# Altium schematic sheet MCU.SchDoc
size A3
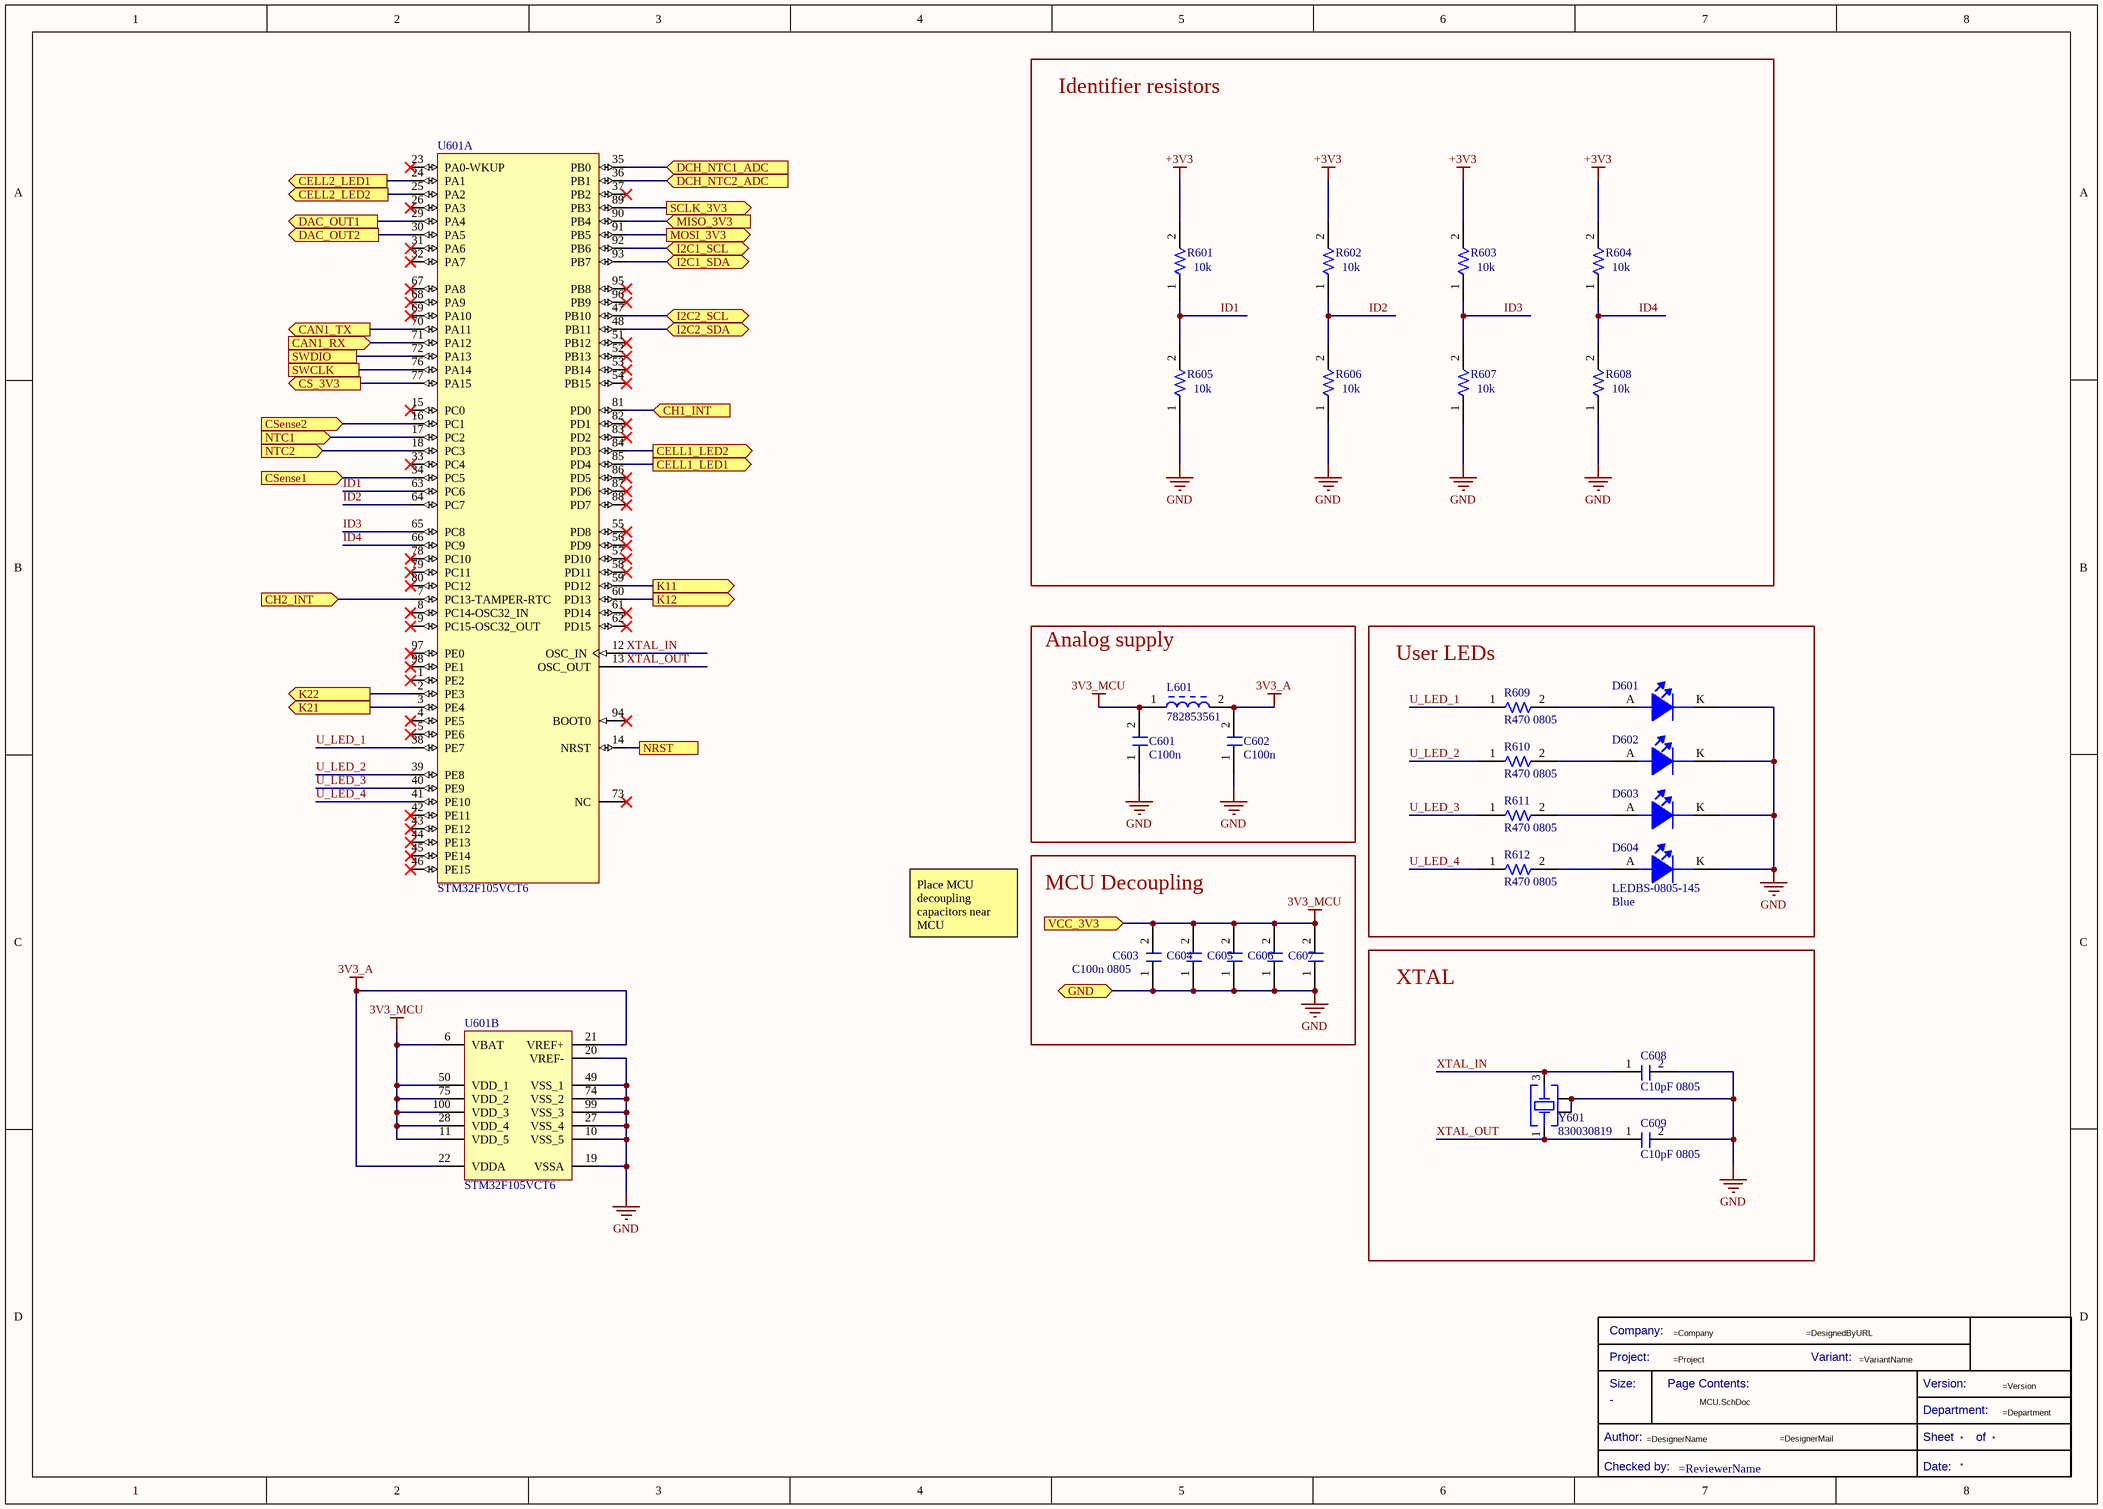
[diagram p0: MCU.SchDoc]

## Parts
*  Title Block_template  (value not drawn)  (graphical)
C601  C100n  [C0805FNPC-R]
C602  C100n  [C0805FNPC-R]
C603  C100n-50V-0805FNPC-X7R  [C0805FNPC-R]  (value not drawn)
C604  C100n-50V-0805FNPC-X7R  [C0805FNPC-R]  (value not drawn)
C605  C100n-50V-0805FNPC-X7R  [C0805FNPC-R]  (value not drawn)
C606  C100n-50V-0805FNPC-X7R  [C0805FNPC-R]  (value not drawn)
C607  C100n 0805  [C0805FNPC-R]
C608  C10pF 0805  [WCAP-CSGP_0805_L2W1.25H0.6_Reflow]
C609  C10pF 0805  [WCAP-CSGP_0805_L2W1.25H0.6_Reflow]
D601  LEDBS-0805-145  [LED_0805_WE]  (value not drawn)
D602  LEDBS-0805-145  [LED_0805_WE]  (value not drawn)
D603  LEDBS-0805-145  [LED_0805_WE]  (value not drawn)
D604  LEDBS-0805-145  Color: Blue  [LED_0805_WE]
L601  782853561  [L_Ferrite_bead_0805]
R601  value 10k  [0805]  (hidden comment: R10k_0805_0.25W)
R602  value 10k  [0805]  (hidden comment: R10k_0805_0.25W)
R603  value 10k  [0805]  (hidden comment: R10k_0805_0.25W)
R604  value 10k  [0805]  (hidden comment: R10k_0805_0.25W)
R605  value 10k  [0805]  (hidden comment: R10k_0805_0.25W)
R606  value 10k  [0805]  (hidden comment: R10k_0805_0.25W)
R607  value 10k  [0805]  (hidden comment: R10k_0805_0.25W)
R608  value 10k  [0805]  (hidden comment: R10k_0805_0.25W)
R609  R470 0805  [R0805FTK]
R610  R470 0805  [R0805FTK]
R611  R470 0805  [R0805FTK]
R612  R470 0805  [R0805FTK]
U601  STM32F105VCT6  [STM-LQFP100_L]  (parts A,B of 2)
Y601  830030819  [WE-XTAL_CFPX-104]

## Blocks framed on the sheet
Identifier resistors: R601-R608
Analog supply: C601 C602 L601
User LEDs: D601-D604 R609-R612
MCU Decoupling: C603-C607
XTAL: C608 C609 Y601

## Ports
CAN1_RX (in), CAN1_TX (out), CELL1_LED1 (out), CELL1_LED2 (out), CELL2_LED1 (out), CELL2_LED2 (out), CH1_INT (in), CH2_INT (in), CS_3V3 (out), CSense1 (in), CSense2 (in), DAC_OUT1 (out), DAC_OUT2 (out), DCH_NTC1_ADC (in), DCH_NTC2_ADC (in), GND (bidir), I2C1_SCL (bidir), I2C1_SDA (bidir), I2C2_SCL (bidir), I2C2_SDA (bidir), K11 (out), K12 (out), K21 (out), K22 (out), MISO_3V3 (in), MOSI_3V3 (out), NRST, NTC1 (in), NTC2 (in), SCLK_3V3 (out), SWCLK, SWDIO, VCC_3V3 (in)

## Nets
3V3_A: C602.2 L601.2 U601.21(VREF+) U601.22(VDDA)
3V3_MCU: C601.2 C603.2 C604.2 C605.2 C606.2 C607.2 L601.1 U601.6(VBAT) U601.11(VDD_5) U601.28(VDD_4) U601.50(VDD_1) U601.75(VDD_2) U601.100(VDD_3) ; port VCC_3V3
+3V3: R601.2 R602.2 R603.2 R604.2
GND: C601.1 C602.1 C603.1 C604.1 C605.1 C606.1 C607.1 C608.2 C609.2 D601.K D602.K D603.K D604.K R605.1 R606.1 R607.1 R608.1 U601.10(VSS_5) U601.19(VSSA) U601.20(VREF-) U601.27(VSS_4) U601.49(VSS_1) U601.74(VSS_2) U601.99(VSS_3) Y601.2(GND_&_Lid) Y601.4(GND_&_Lid) ; port GND
CAN1_RX: U601.71(PA12) ; port CAN1_RX
CAN1_TX: U601.70(PA11) ; port CAN1_TX
CELL1_LED1: U601.85(PD4) ; port CELL1_LED1
CELL1_LED2: U601.84(PD3) ; port CELL1_LED2
CELL2_LED1: U601.24(PA1) ; port CELL2_LED1
CELL2_LED2: U601.25(PA2) ; port CELL2_LED2
CH1_INT: U601.81(PD0) ; port CH1_INT
CH2_INT: U601.7(PC13-TAMPER-RTC) ; port CH2_INT
CS_3V3: U601.77(PA15) ; port CS_3V3
CSense1: U601.34(PC5) ; port CSense1
CSense2: U601.16(PC1) ; port CSense2
DAC_OUT1: U601.29(PA4) ; port DAC_OUT1
DAC_OUT2: U601.30(PA5) ; port DAC_OUT2
DCH_NTC1_ADC: U601.35(PB0) ; port DCH_NTC1_ADC
DCH_NTC2_ADC: U601.36(PB1) ; port DCH_NTC2_ADC
I2C1_SCL: U601.92(PB6) ; port I2C1_SCL
I2C1_SDA: U601.93(PB7) ; port I2C1_SDA
I2C2_SCL: U601.47(PB10) ; port I2C2_SCL
I2C2_SDA: U601.48(PB11) ; port I2C2_SDA
ID1: R601.1 R605.2 U601.63(PC6)
ID2: R602.1 R606.2 U601.64(PC7)
ID3: R603.1 R607.2 U601.65(PC8)
ID4: R604.1 R608.2 U601.66(PC9)
K11: U601.59(PD12) ; port K11
K12: U601.60(PD13) ; port K12
K21: U601.3(PE4) ; port K21
K22: U601.2(PE3) ; port K22
MISO_3V3: U601.90(PB4) ; port MISO_3V3
MOSI_3V3: U601.91(PB5) ; port MOSI_3V3
NRST: U601.14(NRST) ; port NRST
NTC1: U601.17(PC2) ; port NTC1
NTC2: U601.18(PC3) ; port NTC2
SCLK_3V3: U601.89(PB3) ; port SCLK_3V3
SWCLK: U601.76(PA14) ; port SWCLK
SWDIO: U601.72(PA13) ; port SWDIO
U_LED_1: R609.1 U601.38(PE7)
U_LED_2: R610.1 U601.39(PE8)
U_LED_3: R611.1 U601.40(PE9)
U_LED_4: R612.1 U601.41(PE10)
XTAL_IN: C608.1 U601.12(OSC_IN) Y601.3(Crystal)
XTAL_OUT: C609.1 U601.13(OSC_OUT) Y601.1(Crystal)
NetD601_A: D601.A R609.2
NetD602_A: D602.A R610.2
NetD603_A: D603.A R611.2
NetD604_A: D604.A R612.2

Not connected (* = marked no-connect by the designer): U601 1(PE2)* 4(PE5)* 5(PE6)* 8(PC14-OSC32_IN)* 9(PC15-OSC32_OUT)* 15(PC0)* 23(PA0-WKUP)* 26(PA3)* 31(PA6)* 32(PA7)* 33(PC4)* 37(PB2)* 42(PE11)* 43(PE12)* 44(PE13)* 45(PE14)* 46(PE15)* 51(PB12)* 52(PB13)* 53(PB14)* 54(PB15)* 55(PD8)* 56(PD9)* 57(PD10)* 58(PD11)* 61(PD14)* 62(PD15)* 67(PA8)* 68(PA9)* 69(PA10)* 73(NC)* 78(PC10)* 79(PC11)* 80(PC12)* 82(PD1)* 83(PD2)* 86(PD5)* 87(PD6)* 88(PD7)* 94(BOOT0)* 95(PB8)* 96(PB9)* 97(PE0)* 98(PE1)*

## Notes on the sheet
- Place MCU decoupling capacitors near MCU
- (in symbol Title Block_template) Company:; Project:; Variant:; Size:; Page Contents:; Version:; Department:; Author:; Sheet; of; Checked by:; Date:

## Library data of the parts
* = Title Block_template: Standard Title Block; .Creator: GP; Category: Title Block; .PCBcheck: GP; .SCHcheck: GP; Checked by:: =ReviewerName; Size: -
C601 C602 = CMP-00063-3: Cap, 0.1ΜF, 50V, 10%, X7R, 0805; Manufacturer Part Number 1: 885012207098; Manufacturer 1: Wurth Electronics; Value: 100nF; .Creator: DR; ComponentLink2Description: http://www.farnell.com/datasheets/1958498.pdf?src-supplier=Element14; ComponentLink1Description: http://www.farnell.com/datasheets/1958498.pdf?src-supplier=Farnell; Thickness: 0.035inch; ComponentLink1URL: http://www.farnell.com/datasheets/1958498.pdf?src-supplier=Farnell; Min Operating Temperature: -55°C; Packaging: Cut Tape; ComponentLink2URL: http://www.farnell.com/datasheets/1958498.pdf?src-supplier=Element14; Mount: Surface Mount; Voltage Rating (DC): 50V; Tolerance: 10%; Category: Ceramic Capacitors; RoHS: Yes; Width: 0.049inch; Pricing 1: 100=0,10200, 500=0,07100, 2000=0,06100 (GBP); RoHS Compliant: Yes; ComponentLink4Description: http://www.farnell.com/datasheets/1958498.pdf?src-supplier=Newark; Dielectric: X7R; Stock 1: 8000; Length: 0.079inch; ComponentLink3URL: https://katalog.we-online.de/pbs/datasheet/885012207098.pdf?src-supplier=Digi-Key; ComponentLink3Description: https://katalog.we-online.de/pbs/datasheet/885012207098.pdf?src-supplier=Digi-Key; Design Item ID: C100n-50V-0805FNPC-X7R; ComponentLink4URL: http://www.farnell.com/datasheets/1958498.pdf?src-supplier=Newark; REACH SVHC: Unknown; Case Code (Metric): 2012; Voltage Rating: 50V; Max Operating Temperature: 125°C; Source: Passives.SchLib; Case/Package: 0805
C603-C607 = CMP-00063-1: Cap, 0.1ΜF, 50V, 10%, X7R, 0805; Manufacturer 1: Wurth Electronics; Manufacturer Part Number 1: 885012207098; Value: 100nF; .Creator: DR; Pricing 1: 100=0,10200, 500=0,07100, 2000=0,06100 (GBP); ComponentLink1URL: http://www.farnell.com/datasheets/1958498.pdf?src-supplier=Farnell; Design Item ID: C100n-50V-0805FNPC-X7R; Voltage Rating (DC): 50V; Voltage Rating: 50V; Max Operating Temperature: 125°C; RoHS: Yes; Case Code (Metric): 2012; Mount: Surface Mount; REACH SVHC: Unknown; Stock 1: 8000; Source: Passives.SchLib; Tolerance: 10%; RoHS Compliant: Yes; Dielectric: X7R; ComponentLink2Description: http://www.farnell.com/datasheets/1958498.pdf?src-supplier=Element14; ComponentLink2URL: http://www.farnell.com/datasheets/1958498.pdf?src-supplier=Element14; Min Operating Temperature: -55°C; Width: 0.049inch; Category: Ceramic Capacitors; Thickness: 0.035inch; Length: 0.079inch; ComponentLink3URL: https://katalog.we-online.de/pbs/datasheet/885012207098.pdf?src-supplier=Digi-Key; Case/Package: 0805; ComponentLink3Description: https://katalog.we-online.de/pbs/datasheet/885012207098.pdf?src-supplier=Digi-Key; Packaging: Cut Tape; ComponentLink1Description: http://www.farnell.com/datasheets/1958498.pdf?src-supplier=Farnell; ComponentLink4Description: http://www.farnell.com/datasheets/1958498.pdf?src-supplier=Newark; ComponentLink4URL: http://www.farnell.com/datasheets/1958498.pdf?src-supplier=Newark
C608 C609 = CMP-001-00012-2: Ceramic Capacitor, Multilayer, Ceramic, 50V, 5% +Tol, 5% -Tol, C0G, 30ppm/Cel TC, 0.00001uF, Surface Mount, 0805. 885012007051; Pins: 2; RoHS Compliant: Yes; Capacitor Type: Ceramic
D601-D604 = CMP-00129-1: LED BLUE CLEAR 0805 SMD; Manufacturer 1: Wurth Electronics; Manufacturer Part Number 1: 150080BS75000; Lens Style: Clear,Rectangular; Wavelength: 470nm; Forward Voltage: 3.2V; Viewing Angle: 140°; .Creator: GP; Test Current: 20mA; Forward Current: 30mA; Luminous Intensity: 145mcd; ComponentLink2Description: Where buy it; Length: 2mm; RoHS Compliant: Yes; ComponentLink3URL: https://datasheet.ciiva.com/23843/150080bs75000-23843251.pdf?src-supplier=Newark; Min Operating Temperature: -40°C; Stock 1: 7400; Lead Free: Lead Free; Height: 0.7mm; ComponentLink7URL: https://datasheet.ciiva.com/29562/150080bs75000-29562923.pdf?src-supplier=Digi-Key; Case Code (Imperial): 0805; Category: LEDs; Pricing 1: 50=0,19300, 500=0,12900, 1000=0,12200, 2000=0,11700, 4000=0,11100 (USD); ComponentLink4Description: https://datasheet.ciiva.com/22656/1740214-22656954.pdf?src-supplier=Element14; ComponentLink4URL: https://datasheet.ciiva.com/22656/1740214-22656954.pdf?src-supplier=Element14; Packaging: Tape and Reel; ComponentLink1URL: https://www.we-online.com/catalog/datasheet/150080BS75000.pdf; Case/Package: 0805; Mount: Surface Mount; ComponentLink5URL: https://datasheet.ciiva.com/29279/759433-da-01-en-chipled-0805-w-kl-blau-150080bs75000-29279203.pdf?src-supplier=Conrad; ComponentLink1Description: Datasheet; ComponentLink6URL: https://datasheet.ciiva.com/29562/150080bs75000-29562922.pdf?src-supplier=Digi-Key; Dominant Wavelength: 470nm; REACH SVHC: Unknown; Width: 1.25mm; RoHS: Yes; Design Item ID: LEDBS-0805-145; ComponentLink7Description: https://datasheet.ciiva.com/29562/150080bs75000-29562923.pdf?src-supplier=Digi-Key; ComponentLink2URL: https://katalog.we-online.de/en/led/WL-SMCW/150080BS75000; ComponentLink6Description: https://datasheet.ciiva.com/29562/150080bs75000-29562922.pdf?src-supplier=Digi-Key; Max Operating Temperature: 85°C; ComponentLink3Description: https://datasheet.ciiva.com/23843/150080bs75000-23843251.pdf?src-supplier=Newark; Source: Semiconductor.SchLib; Case Code (Metric): 2012; Package Quantity: 4000; ComponentLink5Description: https://datasheet.ciiva.com/29279/759433-da-01-en-chipled-0805-w-kl-blau-150080bs75000-29279203.pdf?src-supplier=Conrad
  D601-D603: Color: Blue
L601 = CMP-00166-1: Manufacturer Part Number: BLM18EG331TN1D; Manufacturer: Murata; .Creator: GP; Tolerance: 25%; Core Material: Ferrite; Impedance: 330R; Max DC Current: 500mA; Resistance: 0.21; Number of Circuits: 1; DC Resistance (DCR): 210mR; Material: Ferrite,Steel; Test Frequency: 100MHz; RoHS: Yes; Case Code (Metric): 1608; ComponentLink6URL: https://datasheet.ciiva.com/3082/l0110s0101blm18e-3082714.pdf?src-supplier=Avnet; ComponentLink7URL: https://datasheet.ciiva.com/6211/l0110s0101blm18e-6211470.pdf?src-supplier=Digi-Key; Width: 0.8mm; ComponentLink6Description: https://datasheet.ciiva.com/3082/l0110s0101blm18e-3082714.pdf?src-supplier=Avnet; Series: BLM18E; Stock 1: 20037; Packaging: Tape and Reel; Max Operating Temperature: 125°C; Case/Package: 0603; ComponentLink8URL: https://datasheet.ciiva.com/6211/l0110s0101blm18e-6211471.pdf?src-supplier=Digi-Key; Case Code (Imperial): 0603; Lead Free: Lead Free; ComponentLink3Description: https://datasheet.ciiva.com/41449/001172267-da-01-en-drossel-0603-330r-1-6x0-8mm-4000st-41449581.pdf?src-supplier=Conrad; Height: 0.8mm; REACH SVHC: No SVHC; ComponentLink1URL: https://datasheet.ciiva.com/1467/5169-1467232.pdf?src-supplier=Element14; Number of Pins: 2; Source: Filter components.SchLib; ComponentLink1Description: https://datasheet.ciiva.com/1467/5169-1467232.pdf?src-supplier=Element14; Depth: 0.8mm; Termination: SMD/SMT; Package Quantity: 1; Min Operating Temperature: -55°C; ComponentLink7Description: https://datasheet.ciiva.com/6211/l0110s0101blm18e-6211470.pdf?src-supplier=Digi-Key; Design Item ID: L_Ferrite_bead_782853561; Length: 1.6mm; ComponentLink4Description: https://datasheet.ciiva.com/1467/5169-1467233.pdf?src-supplier=Element14; ComponentLink8Description: https://datasheet.ciiva.com/6211/l0110s0101blm18e-6211471.pdf?src-supplier=Digi-Key; Current Rating: 500mA; RoHS Compliant: Yes; ComponentLink2Description: https://datasheet.ciiva.com/11795/0900766b811b5866-11795405.pdf?src-supplier=RSComponents; Number of Lines: 1; ComponentLink2URL: https://datasheet.ciiva.com/11795/0900766b811b5866-11795405.pdf?src-supplier=RSComponents; Pricing 1: 1=0,23000, 10=0,17500, 25=0,14520, 50=0,12520, 100=0,11260, 250=0,09508, 500=0,08508, 1000=0,07257 (USD); Max Current Rating: 500mA; ComponentLink5URL: https://datasheet.ciiva.com/1561/5169-1561345.pdf?src-supplier=Newark; ComponentLink4URL: https://datasheet.ciiva.com/1467/5169-1467233.pdf?src-supplier=Element14; Category: Ferrite Beads and Chips; ComponentLink3URL: https://datasheet.ciiva.com/41449/001172267-da-01-en-drossel-0603-330r-1-6x0-8mm-4000st-41449581.pdf?src-supplier=Conrad; ComponentLink5Description: https://datasheet.ciiva.com/1561/5169-1561345.pdf?src-supplier=Newark
R601-R608 = CMP-009-00035-3: Resistor, 10K, 0.25W, Thick Film, 0805 Rohs Compliant: Yes
R609-R612 = CMP-00093-1: Res Thick Film 0805 470 Ohm 1% 1/8W ±100ppm/°C Molded SMD SMD Paper Tape on Plastic Reel; Manufacturer 1: Bourns; Manufacturer Part Number 1: CR0805-FX-4700GLF; Max Power Dissipation: 125mW; Voltage Rating: 150V; Value: 470; .Creator: DR; Min Operating Temperature: -55°C; Mount: Surface Mount; Series: CR0805; Termination: SMD/SMT; REACH SVHC: No SVHC; Depth: 1.25mm; RoHS: Yes; ComponentLink3Description: https://datasheet.ciiva.com/22693/1902866-22693247.pdf?src-supplier=Element14; Max Operating Temperature: 155°C; ComponentLink2Description: https://datasheet.ciiva.com/7985/1856384-7985880.pdf?src-supplier=Element14; Resistor Type: Thick Film; Construction: Rectangular; Number of Terminations: 2; Pins: 2; Length: 2mm; Case Code (Metric): 2012; Category: Chip SMD Resistors; Design Item ID: R470-0805FTK; ComponentLink4Description: https://datasheet.ciiva.com/5541/chpreztr-5541930.pdf?src-supplier=Mouser; Pricing 1: 1=0,00990, 10=0,00980, 25=0,00950, 50=0,00940, 100=0,00930, 250=0,00920, 500=0,00910, 1000=0,00890, 3000=0,00870, 6000=0,00860 (USD); ComponentLink4URL: https://datasheet.ciiva.com/5541/chpreztr-5541930.pdf?src-supplier=Mouser; Tolerance: 1%; Technology: THICK FILM; Packaging: Tape and Reel; Military Standard: Not; Temperature Coefficient: 100ppm/°C; Height: 0.5mm; Thickness: 508um; Stock 1: 12623; Contact Plating: Tin; Case/Package: 0805; Features: Moisture Resistant; ComponentLink1Description: https://datasheet.ciiva.com/11808/0900766b80fcdb72-11808686.pdf?src-supplier=RSComponents; ComponentLink3URL: https://datasheet.ciiva.com/22693/1902866-22693247.pdf?src-supplier=Element14; Voltage Rating (DC): 150V; Power Rating: 125mW; ComponentLink1URL: https://datasheet.ciiva.com/11808/0900766b80fcdb72-11808686.pdf?src-supplier=RSComponents; Resistance Tolerance: 1%; ComponentLink2URL: https://datasheet.ciiva.com/7985/1856384-7985880.pdf?src-supplier=Element14; Radiation Hardening: No; Source: Passives.SchLib
U601 = CMP-031-00011-1: RISC Microcontroller, 32-Bit, FLASH, CORTEX-M3 CPU, 72MHz, CMOS, PQFP100; Max Supply Voltage: 3.6V; Min Supply Voltage: 2V; Case/Package: LFQFP; RoHS Compliant: Yes; Max Operating Temperature: 85°C; Pins: 100; Min Operating Temperature: -40°C
Y601 = CMP-003-00000-1: WE-XTAL Quartz Crystal, SMT, CFPX-104, 16MHz, +/-50ppm; Manufacturer: Wurth Elektronik; Load Capacitance: 18pF; ComponentLink2Description: Datasheet Link; Manufacturer Part Number: 830030819; Match Code: WE-XTAL; ComponentLink1Description: Website Link; Width: 3.2mm; Source: WE-XTAL.SchLib; Category: Crystals; Mount: Surface Mount; Frequency: 16MHz; Operating Temperature Max: 60°C; Frequency Tolerance: +/-50ppm; Pins: 4; Design Item ID: 830030819; Component Type: Standard; Length: 5mm; Height: 1mm; Frequency Stability: +/-50ppm; Operating Temperature Min: -10°C; ComponentLink2URL: https://www.we-online.com/redexpert/spec/830030819?ad; ComponentLink1URL: https://www.we-online.com/redexpert/article/830030819?ad; Packaging: Tape and Reel; Case/Package: CFPX-104